# EAGLE design bristol_longshot (EAGLE 6.5.0)
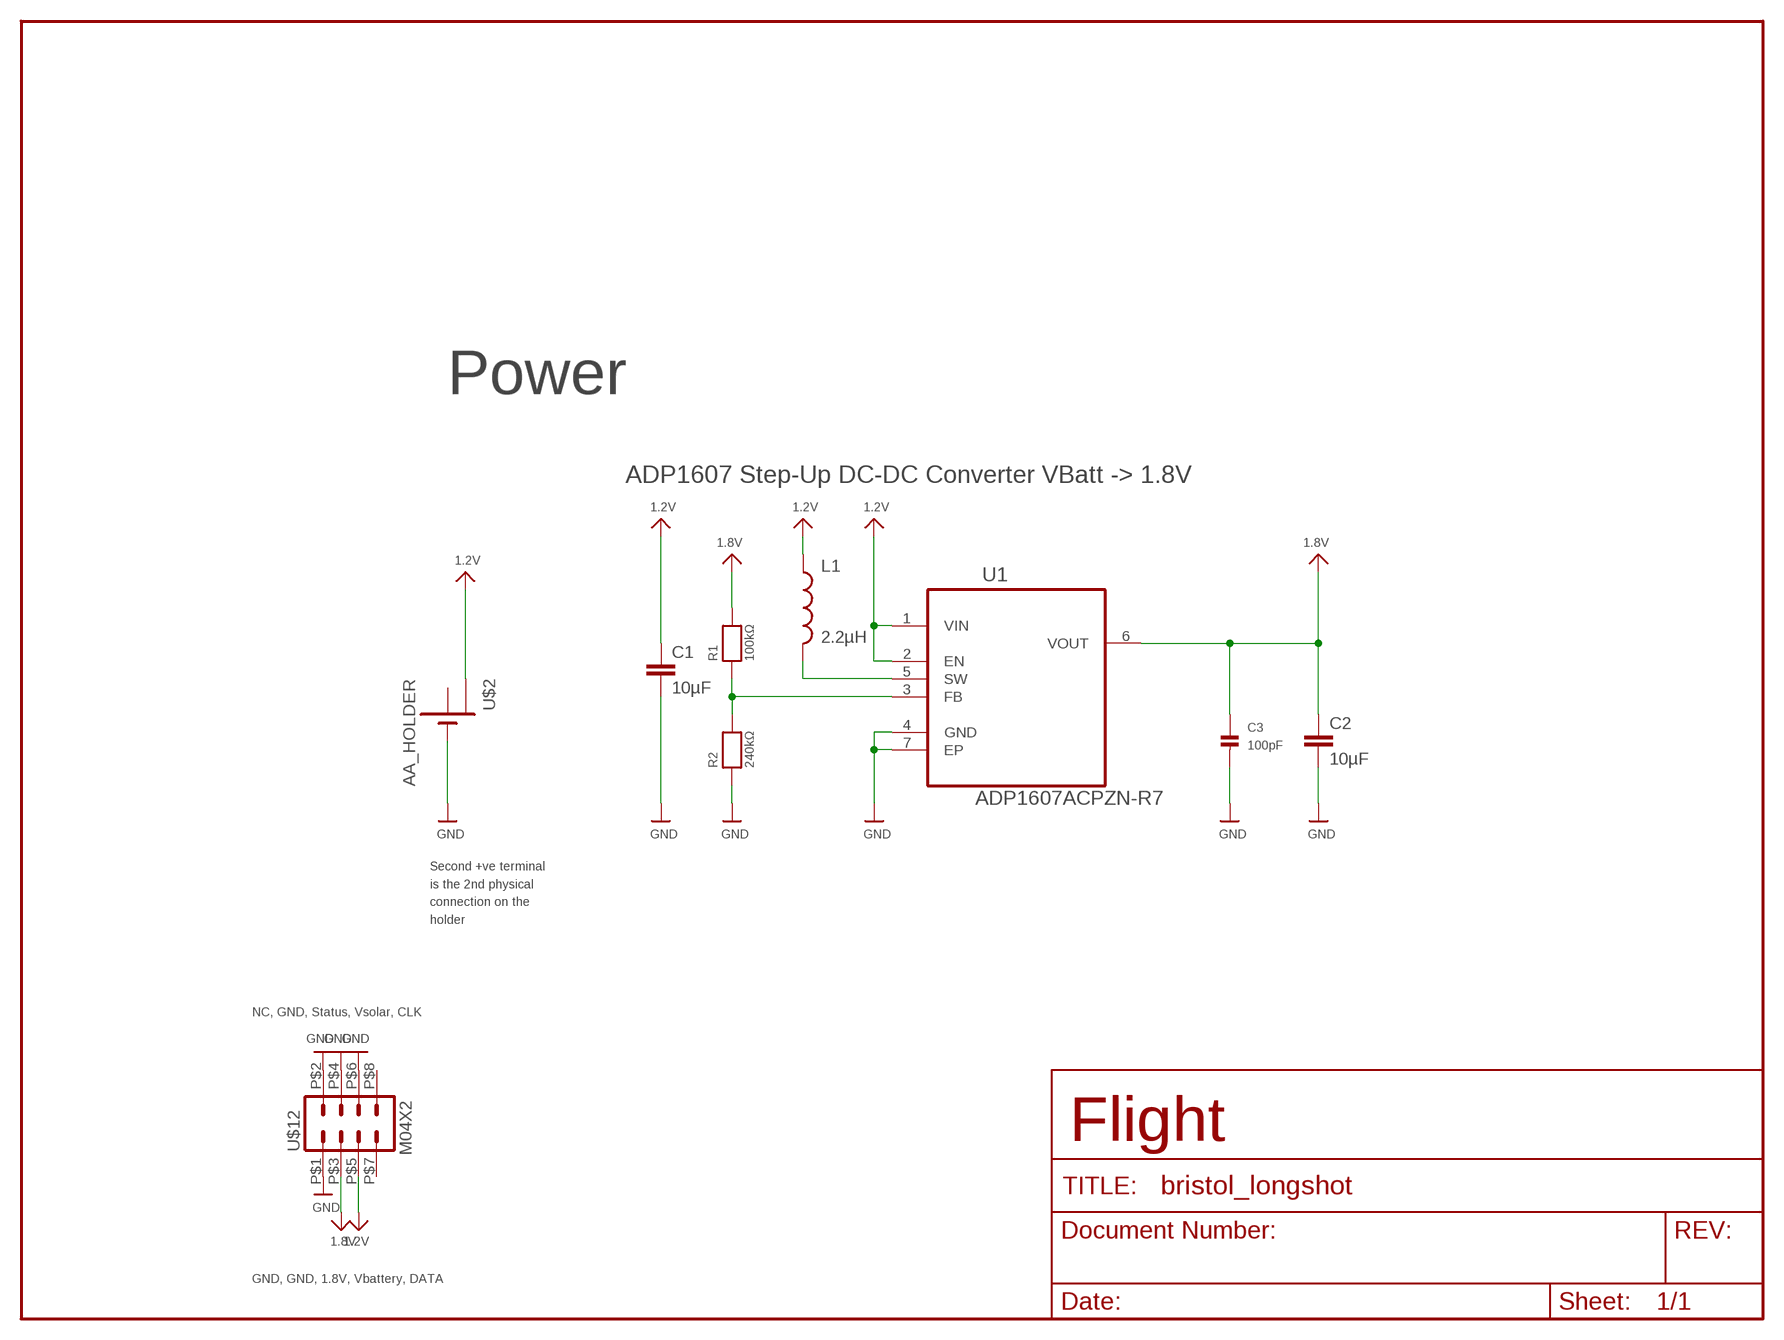
[diagram p0: schematic, sheet 1]

## Parts
C1  10µF  C-EUC0603K  [C0603K]
C2  10µF  C-EUC0603K  [C0603K]
C3  100pF  CAP_CERAMIC_0402  [_0402]
L1  2.2µH  INDUCTOR1007  [1007]
R1  100kΩ  RESISTOR_0402  [_0402]
R2  240kΩ  RESISTOR_0402  [_0402]
U1  ADP1607ACPZN-R7  [DFN200X200X60-7N]
U$2  AA_HOLDER  [AA]
U$12  M04X2  [M04X2]

## Nets
1.2V: C1.1 L1.1 U1.1(VIN) U1.2(EN) U$2.+1(+2) U$12.P$5
1.8V: C2.1 C3.1 R1.2 U1.6(VOUT) U$12.P$3
FB: R1.1 R2.2 U1.3(FB)
GND: C1.2 C2.2 C3.2 R2.1 U1.4(GND) U1.7(EP) U$2.-1(-) U$2.-2(-) U$12.P$1 U$12.P$2 U$12.P$4 U$12.P$6
SW: L1.2 U1.5(SW)
Unconnected: U$12.P$7 U$12.P$8

## Notes on the sheet
- Power
- ADP1607 Step-Up DC-DC Converter VBatt -> 1.8V
- Second +ve terminal
  is the 2nd physical
  connection on the
  holder
- NC, GND, Status, Vsolar, CLK
- Flight
- GND, GND, 1.8V, Vbattery, DATA

## Power pins joined to a net without a drawn wire
+: U$2.+2(+)

## Library data of the parts
C1 C2 = resistor:C-EU: CAPACITOR, European symbol
C3 = microbuilder_v3:CAP_CERAMIC: Ceramic Capacitors 0402 - 0402 Surface Mount Capacitors 16pF 50V 5% [Digikey: 445-4899-2-ND] 18pF 50V 5% [Digikey: 490-1281-2-ND] 22pF 50V 5% [Digikey: 490-1283-2-ND] 68pF 50V 5% [Digikey: 490-1289-2-ND] 0.1uF 10V 10% [Digikey: 490-1318-2-ND] 1.0uF 6.3V 10% [Digikey: 490-1320-2-ND] 0603 - 0603 Surface Mount Capacitors 16 pF 50V 5% [Digikey: 445-5051-2-ND] 22 pF 50V [Digikey: PCC220ACVTR-ND] 33 pF 50V 5% [Digikey: 490-1415-1-ND] 56pF 50V 5% [Digikey: 490-1421-1-ND] 220pF 50V 5% [Digikey: 445-1285-1-ND] 680 pF 50V 2200 pF 50V 5% C0G [Digikey: 445-1297-1-ND] 5600 pF 100V 5% X7R [Digikey: 478-3711-1-ND] 0.1 µF 25V 10% [Digikey: PCC2277TR-ND] 0.22 µF 16V 10% X7R [Digikey: 445-1318-1-ND] 1.0 µF 25V 10% [Digikey: 445-5146-2-ND] 0603 - RF Specific 3pF 250V +/-0.1pF RF [Digikey: 712-1347-1-ND] 18 pF 250V 5% [Digikey: 478-3505-1-ND or 712-1322-1-ND] 56 pF 250V 5% C0G RF [Digikey: 490-4867-1-ND] 68 pF 250V RF [Digikey: 490-4868-1-ND] 0805 - 0805 Surface Mount Capacitors 220 pF 250V 2% RF Ceramic Capacitor [Digikey: 712-1398-1-ND] 1000 pF 50V 2% NP0 Ceramic Capacitor [Digikey: 478-3760-1-ND] 0.1 µF 25V 10% Ceramic Capacitor [Digikey: PCC1828TR-ND] 1.0 µF 16V 10% Ceramic Capacitor[Digikey: 490-1691-2-ND] 10.0 µF 10V 10% Ceramic Capacitor[Digikey: 709-1228-1-ND] 10.0 uF 16V 10% Ceramic Capacitor [Digikey: 478-5165-2-ND] 47 uF 6.3V 20% Ceramic Capacitor [Digikey: 587-1779-1-ND or 399-5506-1-ND] 1206 - 1206 Surface Mount Capacitors 47uF 10V 20% Ceramic Capacitor [Digikey: 490-5528-1-ND or 399-5508-1-ND or 445-6010-1-ND] 100uF 6.3V -20%, +80% Y5V Ceramic Capacitor (Digikey: 490-4512-1-ND, Mouser: 81-GRM31CF50J107ZE1L)
L1 = SparkFun:INDUCTOR: Inductors Basic Inductor/Choke - 0603 and 1206. Footprints are not proven and vary greatly between part numbers.
R1 R2 = microbuilder_v3:RESISTOR: Resistors 0402 - 0402 Surface Mount Package 22 Ohm 1% 1/16W [Digikey: 311-22.0LRTR-ND] 33 Ohm 5% 1/16W 1.0K 5% 1/16W 1.5K 5% 1/16W 2.0K 1% 1/16W 10.0K 1% 1/16W [Digikey: 311-10.0KLRTR-ND] 10.0K 5% 1/16W [Digikey: RMCF0402JT10K0TR-ND] 12.1K 1% 1/16W [Digikey: 311-22.0LRTR-ND] 100.0K 5% 1/16W 0603 - 0603 Surface Mount Package 0 Ohm 1/10 Watt 1% Resistor 15 Ohm 1/10 Watt 1% Resistor 33 Ohm 1/10 Watt 1% Resistor 49.9 Ohm 1/10 Watt 1% Resistor 100 Ohm 1/10 Watt 1% Resistor 150 Ohm 1/10 Watt 1% Resistor 240 Ohm 1/10 Watt 1% Resistor 390 Ohm 1/10 Watt 1% Resistor 560 Ohm 1/10 Watt 1% Resistor 680 Ohm 1/10 Watt 1% Resistor 750 Ohm 1/10 Watt 1% Resistor 1.0K Ohm 1/10 Watt 1% Resistor 1.5K Ohm 1/10 Watt 1% Resistor 2.0K Ohm 1/10 Watt 1% Resistor 2.2K Ohm 1/10 Watt 1% Resistor 3.3K Ohm 1/10 Watt 1% Resistor 4.7K Ohm 1/10 Watt 1% Resistor 10.0K Ohm 1/10 Watt 1% Resistor 12.0K Ohm 1/10 Watt 1% Resistor 12.1K Ohm 1/10 Watt 1% Resistor 20.0K Ohm 1/10 Watt 1% Resistor 33.0K Ohm 1/10 Watt 1% Resistor 100.0K Ohm 1/10 Watt 1% Resistor 0805 - 0805 Surface Mount Package 0 Ohm 1/8 Watt 1% Resistor 33 Ohm 1/8 Watt 1% Resistor 100 Ohm 1/8 Watt 1% Resistor 150 Ohm 1/8 Watt 1% Resistor 200 Ohm 1/8 Watt 1% Resistor 240 Ohm 1/8 Watt 1% Resistor 330 Ohm 1/8 Watt 1% Resistor 390 Ohm 1/8 Watt 1% Resistor 470 Ohm 1/8 Watt 1% Resistor 1.0K Ohm 1/8 Watt 1% Resistor 1.5K Ohm 1/8 Watt 1% Resistor 2.0K Ohm 1/8 Watt 1% Resistor 4.7K Ohm 1/8 Watt 1% Resistor 5.1K Ohm 1/8 Watt 1% Resistor 5.6K Ohm 1/8 Watt 1% Resistor 10.0K Ohm 1/8 Watt 1% Resistor 22.0K Ohm 1/8 Watt 1% Resistor 33.0K Ohm 1/8 Watt 1% Resistor 100K Ohm 1/8 Watt 1% Resistor 1206 - 1206 Surface Mount Package 2012 - 2010 Surface Mount Package 0.11 Ohm 1/2 Watt 1% Resistor - Digikey: RHM.11UCT-ND
U1 = ADP1607:ADP1607ACPZN-R7: IC BOOST, 0.8-3.3V, 2MHZ, 1.8-3.3V, 6LFCSP; MPN: ADP1607ACPZN-R7; OC_FARNELL: 2254940; OC_NEWARK: 54W6610; PACKAGE: 6LFCSP; SUPPLIER: ANALOG DEVICES
U$2 = fbri:AA_HOLDER
U$12 = fbri:M04X2

## Board
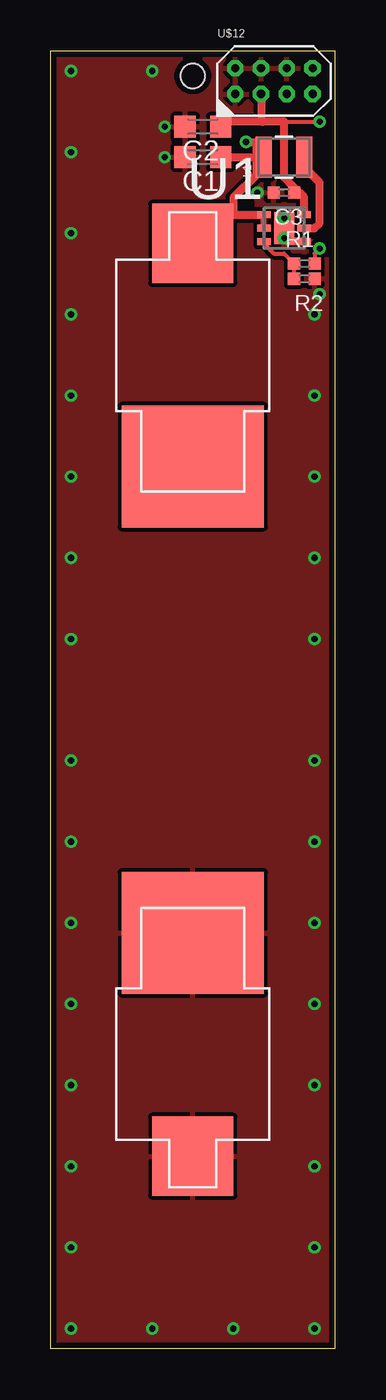
[diagram p1: board, top side]
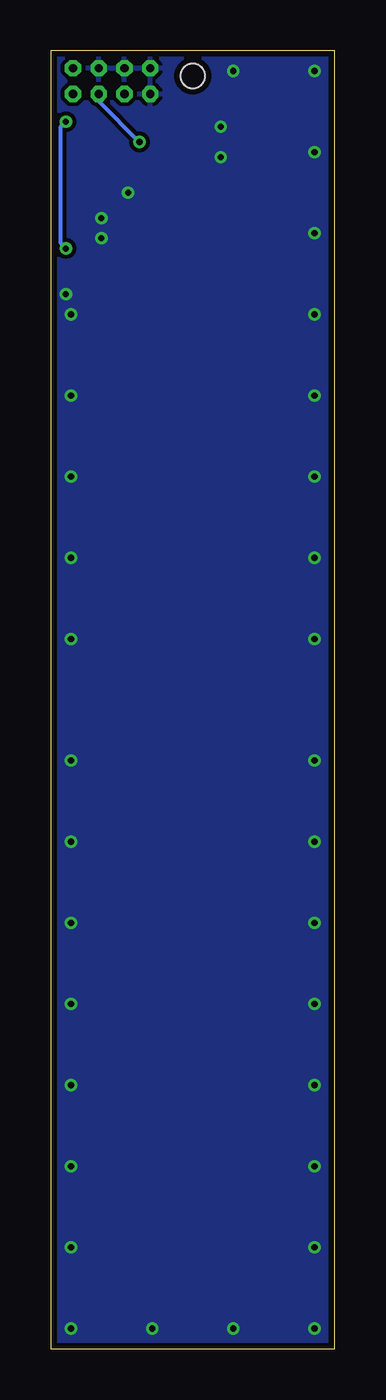
[diagram p2: board, bottom side, seen from below]

Size 14 x 64 mm. Coordinates in mm from the lower left corner, seen from the top.
Outline: 0,0 0,64 14,64 14,0 0,0
Copper layers (1*16): Top 0.035mm / dielectric 1.5mm / Bottom 0.035mm
Design rules "PCB-POOL Standard *": minimum track width 0.15mm, minimum drill 0.3mm, track to track 0.15mm, track to pad 0.15mm, pad to pad 0.15mm, via to via 0.15mm, smd to smd 0.15mm, copper to edge 0.3mm, drill to drill 0.2mm, minimum pad ring 0.2mm, minimum via ring 0.15mm, stop-mask expansion 0.075mm, vias tented up to drill 0.3mm, thermal gap 0.2mm
Holes 1.2 mm at 7,62.75
tRestrict: area 9.5,56.4 to 9.7,56.6

### Footprints (pad centres in the part's own frame; a part is rotated, then mirrored left to right if it is on the bottom)
C0603K = smd 1.05 x 1.08: 1 -0.875,0; 2 0.875,0
_0402 = smd 0.6 x 0.6: 1 -0.508,0; 2 0.508,0
1007 = smd 2 x 0.8: 1 0,1; 2 0,-1
DFN200X200X60-7N = smd 0.66 x 0.356: 1 -0.991,0.66; 2 -0.991,0; 3 -0.991,-0.66; 4 0.991,-0.66; 5 0.991,0; 6 0.991,0.66 | smd 0.991 x 1.6: 7 0,0
AA = smd 4 x 3.9: +1 0,22.5; -1 0,-22.5 | smd 7 x 6: +2 0,11.5; -2 0,-11.5
M04X2 = drill 0.4 octagon: P$1 -1.905,-0.635; P$2 -1.905,0.635; P$3 -0.635,-0.635; P$4 -0.635,0.635; P$5 0.635,-0.635; P$6 0.635,0.635; P$7 1.905,-0.635; P$8 1.905,0.635

### Placement (x,y rotation side)
C1  7.5,58.75 180 top
C2  7.5,60.25 180 top
C3  11.5,57 180 top
L1  11.5,58.75 90 top
R1  12.5,53.5 0 top
R2  12.5,52.75 180 top
U1  11.5,55.25 0 top
U$2  7,32 0 top
U$12  11,62.5 0 top

### Tracks (layer width: path | path; a pad name or v marks a point on that pad's centre or on a via)
1.2V  (via drill 0.3)
  Top 0.305: U1.2 U1.1
  Top 0.4: 9,55.91 U1.1 | L1.1 10.5,58.25 | 10.5,58 10.5,58.25 | 10.5,58.25 10.12,57.88 | 10.12,57.88 9,56.75 9,55.91 | C1.1 10.12,58.75 | 10.12,58.75 10.12,57.88 | v9.62,59.5 10.12,59.5 10.12,58.75 | 9,55.91 8.41,55.91 U$2.+1
  Bottom 0.2: v9.62,59.5 11.63,61.51 U$12.P$5
1.8V  (via drill 0.3)
  Top 0.2: 11.5,60.5 v13.25,60.5 | v13.25,54.25 13.01,54.01 R1.2
  Top 0.4: U1.6 12.49,56.77 12,57.25 | C3.1 12,57.25 | 12,57.25 11.5,57.76 11.5,60.5 10.5,60.5 10.37,60.5 | 10.37,60.5 8.62,60.5 C2.1 | U$12.P$3 10.37,60.5
  Bottom 0.2: v13.25,54.25 13.5,54.5 13.5,60.25 v13.25,60.5
FB
  Top 0.2: U1.3 10.5,54.5 11,54 11.5,54 R1.1 R2.2
GND  (via drill 0.3)
  Top 0.4: U1.4 11.66,54.59 v11.5,54.75
  other vias: 11.5,55.75 5.62,58.75 5.62,60.25 10.19,57 13.25,52 1,63 5,63 1,59 1,55 1,51 1,47 1,1 13,1 9,1 5,1 1,5 1,9 1,13 1,17 1,21 1,25 1,29 1,43 1,39 1,35 13,5 13,9 13,13 13,17 13,21 13,25 13,29 13,35 13,39 13,43 13,47 13,51
  pour Top (isolate 0.2): 0,64 14,64 15,-1 0,0
  pour Bottom (isolate 0.2): 0,64 14,64 15,0 0,0
SW
  Top 0.4: U1.5 13,55.25 13.25,55.5 13.25,57.5 12.75,58 L1.2

### Text on the board
tStop: UNIVERSITY | OF | BRISTOL | AAA / Battery